# Altium schematic sheet Sheet1.SchDoc
size A4; SheetNumber: 1; SheetTotal: 1
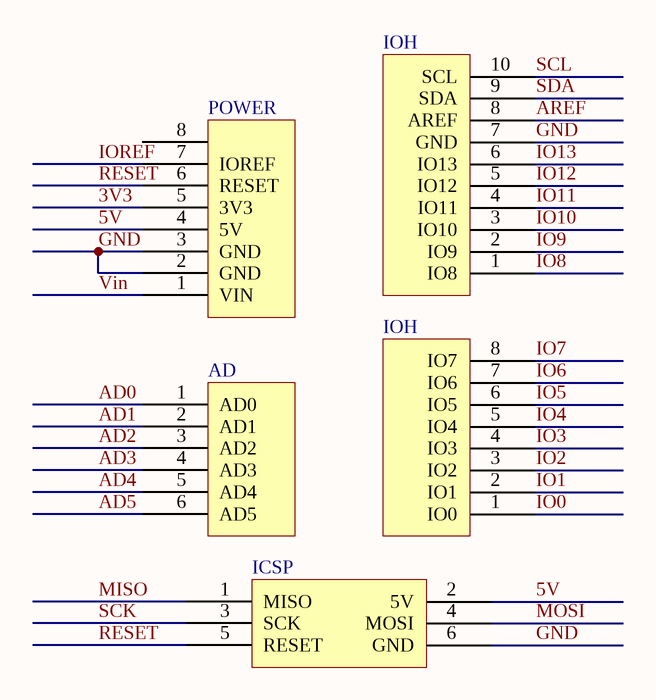
[diagram p0: Sheet1.SchDoc]

## Parts
AD  AD  [AD]  (value not drawn)
ICSP  ICSP  [ICSP]  (value not drawn)
IOH_1  IOH 1  [IOH 1]  (value not drawn)
IOH_2  IOH 2  [IOH 2]  (value not drawn)
POWER  POWER  [POWER]  (value not drawn)

## Nets
3V3: POWER.5(3V3)
5V: ICSP.2(5V) POWER.4(5V)
AD0: AD.1(AD0)
AD1: AD.2(AD1)
AD2: AD.3(AD2)
AD3: AD.4(AD3)
AD4: AD.5(AD4)
AD5: AD.6(AD5)
AREF: IOH_1.8(AREF)
GND: ICSP.6(GND) IOH_1.7(GND) POWER.2(GND) POWER.3(GND)
IO0: IOH_2.1(IO0)
IO1: IOH_2.2(IO1)
IO2: IOH_2.3(IO2)
IO3: IOH_2.4(IO3)
IO4: IOH_2.5(IO4)
IO5: IOH_2.6(IO5)
IO6: IOH_2.7(IO6)
IO7: IOH_2.8(IO7)
IO8: IOH_1.1(IO8)
IO9: IOH_1.2(IO9)
IO10: IOH_1.3(IO10)
IO11: IOH_1.4(IO11)
IO12: IOH_1.5(IO12)
IO13: IOH_1.6(IO13)
IOREF: POWER.7(IOREF)
MISO: ICSP.1(MISO)
MOSI: ICSP.4(MOSI)
RESET: ICSP.5(RESET) POWER.6(RESET)
SCK: ICSP.3(SCK)
SCL: IOH_1.10(SCL)
SDA: IOH_1.9(SDA)
Vin: POWER.1(VIN)

Not connected (* = marked no-connect by the designer): POWER 8

## Notes on the sheet
- (in symbol IOH 1) IOH
- (in symbol IOH 2) IOH